# Altium project lr3 (1).PrjPcb
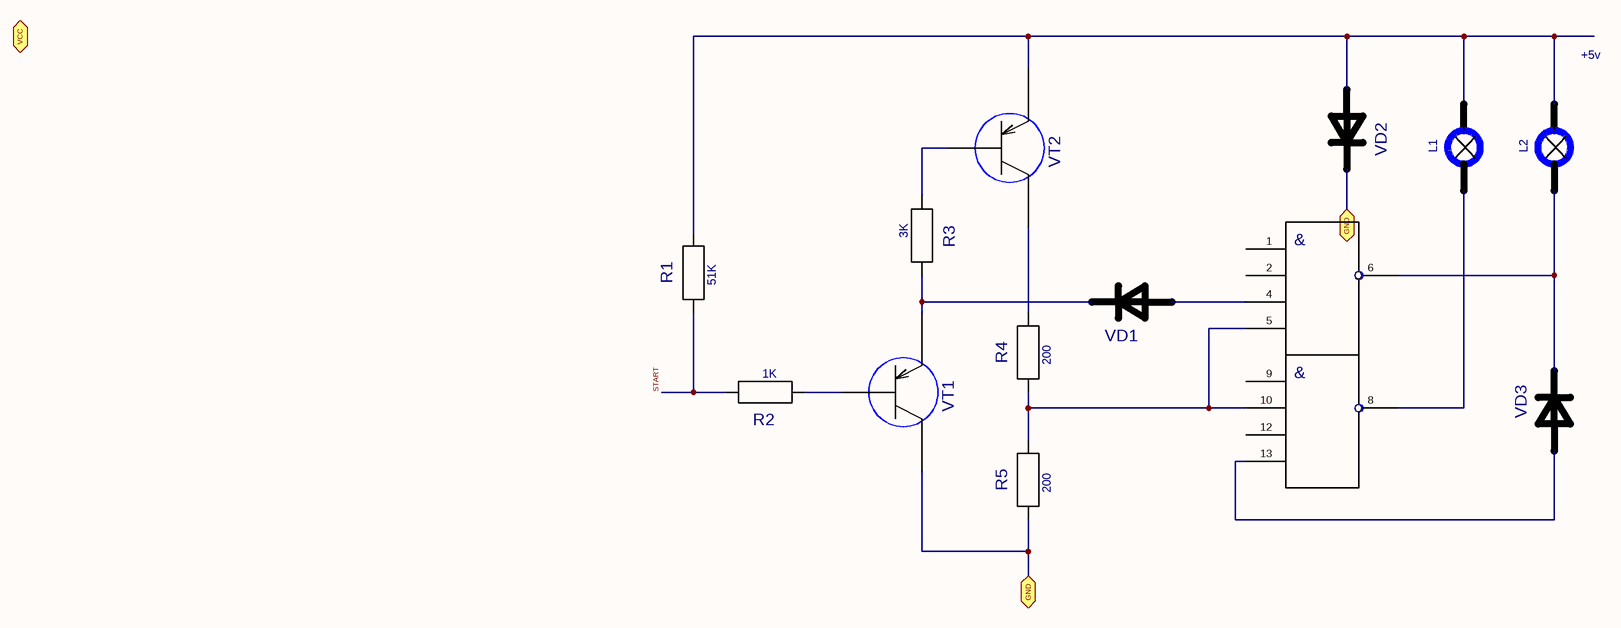
[diagram p0: Sheet1.SCHDOC]
1 sheet, 13 parts. Net scope: global (net labels, ports and power ports of the same name join across sheets).

## Sheet Sheet1.SCHDOC
size 420 x 297 mm; SheetNumber: 1; SheetTotal: 1; DocumentName: Sheet1.SCHDOC

### Parts
DD2  Ê155ËÀ1  [201.14-1]  (value not drawn)  (parts A,B of 2)
L1  ÑÌÍ6.3-20-2  [HL_MINI]  (value not drawn)
L2  ÑÌÍ6.3-20-2  [HL_MINI]  (value not drawn)
R1  value 51K  [C2-33H-2W]  (hidden comment: Ñ2-23-2 ÂÒ)
R2  value 1K  [C2-33H-2W]  (hidden comment: Ñ2-23-2 ÂÒ)
R3  value 3K  [C2-33H-2W]  (hidden comment: Ñ2-23-2 ÂÒ)
R4  value 200  [C2-33H-2W]  (hidden comment: Ñ2-23-2 ÂÒ)
R5  value 200  [C2-33H-2W]  (hidden comment: Ñ2-23-2 ÂÒ)
VD1  1N34  [DO-7]  (value not drawn)
VD2  1N34  [DO-7]  (value not drawn)
VD3  1N34  [DO-7]  (value not drawn)
VT1  1Ò320À  [ÃÒ320Á]  (value not drawn)
VT2  1Ò320À  [ÃÒ320Á]  (value not drawn)

### Ports
GND, VCC

### Nets
GND: DD2.7(GND)
VCC: DD2.14(VCC)
GND: R5.1(I/O0) VD2.K VT1.2(K) ; port GND  [a separate net that carries the same name]
START: R1.1(I/O0) R2.2(I/O1)
NetDD2_4: DD2.4 VD1.A
NetDD2_5: DD2.5 DD2.10 R4.1(I/O0) R5.2(I/O1)
NetDD2_6: DD2.6 L2.1 VD3.K
NetDD2_8: DD2.8 L1.1
NetDD2_13: DD2.13 VD3.A
NetL1_2: L1.2 L2.2 R1.2(I/O1) VD2.A VT2.1(E)
NetR2_1: R2.1(I/O0) VT1.3(B)
NetR3_1: R3.1(I/O0) VT2.3(B)
NetR3_2: R3.2(I/O1) VD1.K VT1.1(E)
NetR4_2: R4.2(I/O1) VT2.2(K)

Not connected (* = marked no-connect by the designer): DD2 1 2 3 9(1) 11 12(4)

### Notes on the sheet
- +5v
- (in symbol Ê155ËÀ1, part A) &
- (in symbol Ê155ËÀ1, part B) &

### Library data of the parts
DD2 = Ê155ËÀ1: Value: *
VD1-VD3 = 1N34: Value: *
VT1 VT2 = 1Ò320À: Value: *